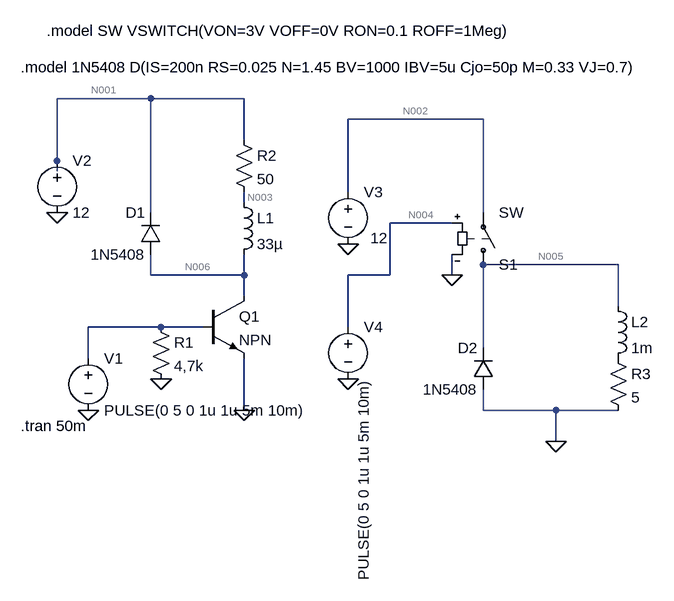
[diagram p0: schematic Díode de protecció.asc]
Díode de protecció.asc, the LTspice schematic file:
Version 4
SHEET 1 912 680
WIRE 64 -272 -80 -272
WIRE 208 -272 64 -272
WIRE 576 -240 368 -240
WIRE 208 -208 208 -272
WIRE -80 -176 -80 -272
WIRE -80 -160 -80 -176
WIRE 368 -128 368 -240
WIRE 208 -112 208 -128
WIRE 64 -96 64 -272
WIRE 576 -96 576 -240
WIRE 528 -80 432 -80
WIRE 784 -16 576 -16
WIRE 64 0 64 -32
WIRE 208 0 208 -32
WIRE 208 0 64 0
WIRE 432 0 432 -80
WIRE 432 0 368 0
WIRE 528 0 528 -32
WIRE 208 32 208 0
WIRE 784 48 784 -16
WIRE 80 80 -32 80
WIRE 144 80 80 80
WIRE 368 80 368 0
WIRE 576 112 576 -16
WIRE -32 128 -32 80
WIRE 208 208 208 128
WIRE 576 208 576 176
WIRE 688 208 576 208
WIRE 784 208 688 208
WIRE 688 256 688 208
FLAG -32 208 0
FLAG 208 208 0
FLAG -80 -96 0
FLAG 80 160 0
FLAG 368 -48 0
FLAG 688 256 0
FLAG 528 0 0
FLAG 368 160 0
SYMBOL voltage -32 112 R0
WINDOW 123 0 0 Left 0
WINDOW 39 0 0 Left 0
SYMATTR InstName V1
SYMATTR Value PULSE(0 5 0 1u 1u 5m 10m)
SYMBOL npn 144 32 R0
SYMATTR InstName Q1
SYMBOL ind 192 -128 R0
SYMATTR InstName L1
SYMATTR Value 33µ
SYMBOL diode 80 -32 R180
WINDOW 0 24 64 Left 2
WINDOW 3 24 0 Left 2
SYMATTR InstName D1
SYMATTR Value 1N5408
SYMBOL voltage -80 -192 R0
WINDOW 123 0 0 Left 0
WINDOW 39 0 0 Left 0
SYMATTR InstName V2
SYMATTR Value 12
SYMBOL res 192 -224 R0
SYMATTR InstName R2
SYMATTR Value 50
SYMBOL res 64 64 R0
SYMATTR InstName R1
SYMATTR Value 4,7k
SYMBOL voltage 368 -144 R0
WINDOW 3 34 87 Left 2
WINDOW 123 0 0 Left 0
WINDOW 39 0 0 Left 0
SYMATTR InstName V3
SYMATTR Value 12
SYMBOL ind 768 32 R0
SYMATTR InstName L2
SYMATTR Value 1m
SYMBOL res 768 112 R0
SYMATTR InstName R3
SYMATTR Value 5
SYMBOL diode 592 176 R180
WINDOW 0 24 64 Left 2
WINDOW 3 24 0 Left 2
SYMATTR InstName D2
SYMATTR Value 1N5408
SYMBOL sw 576 0 M180
SYMATTR InstName S1
SYMBOL voltage 368 64 R0
WINDOW 3 24 96 VRight 2
WINDOW 123 0 0 Left 0
WINDOW 39 0 0 Left 0
SYMATTR InstName V4
SYMATTR Value PULSE(0 5 0 1u 1u 5m 10m)
TEXT -136 -320 Left 2 !.model 1N5408 D(IS=200n RS=0.025 N=1.45 BV=1000 IBV=5u Cjo=50p M=0.33 VJ=0.7)
TEXT -136 232 Left 2 !.tran 50m
TEXT -96 -376 Left 2 !.model SW VSWITCH(VON=3V VOFF=0V RON=0.1 ROFF=1Meg)

The netlist it stands for:
* Díode de protecció.asc
V1 N007 0 PULSE(0 5 0 1u 1u 5m 10m)
Q1 N006 N007 0 0 NPN
L1 N003 N006 33µ
D1 N006 N001 1N5408
V2 N001 0 12
R2 N001 N003 50
R1 N007 0 4,7k
V3 N002 0 12
L2 N005 P001 1m
R3 P001 0 5
D2 0 N005 1N5408
S1 N005 N002 N004 0 SW
V4 N004 0 PULSE(0 5 0 1u 1u 5m 10m)
.model D D
.lib standard.dio
.model NPN NPN
.model PNP PNP
.lib standard.bjt
.model 1N5408 D(IS=200n RS=0.025 N=1.45 BV=1000 IBV=5u Cjo=50p M=0.33 VJ=0.7)
.tran 50m
.model SW VSWITCH(VON=3V VOFF=0V RON=0.1 ROFF=1Meg)
.backanno
.end

* Results of the author's LTspice run, read from the files saved beside the schematic
* Operating Point, zero values left out:
*   V(n006) = 12 V
*   V(n003) = 12 V
*   V(n001) = 12 V
*   V(n002) = 12 V
*   V(n005) = 60.01 µV
*   V(p001) = 60 µV
*   Ic(Q1) = 12 pA
*   Ib(Q1) = -12 pA
*   I(D2) = -319.8 pA
*   I(L1) = 10.66 pA
*   I(L2) = 12 µA
*   I(R2) = 9.595 pA
*   I(R3) = 12 µA
*   I(S1) = 12 µA
*   I(V1) = 12 pA
*   I(V2) = -9.99 pA
*   I(V3) = -12 µA
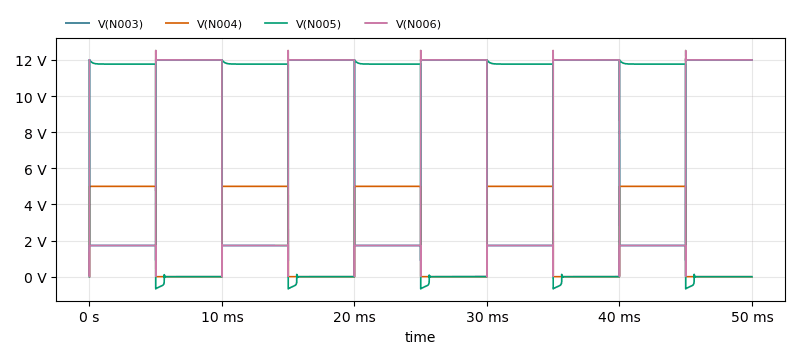
[diagram p1: Transient Analysis of Díode de protecció.asc, plotted from the saved traces]
* Transient Analysis, 1 run:
*   V(N003): min 886.1 mV, max 12.01 V, average 6.862 V, rms 8.571 V, last 12 V
*   V(N004): min 0 V, max 5 V, average 2.501 V, rms 3.536 V, last 0 V
*   V(N005): min -669.2 mV, max 12 V, average 5.854 V, rms 8.328 V, last 57.56 µV
*   V(N006): min 17.93 mV, max 12.53 V, average 6.861 V, rms 8.571 V, last 12 V